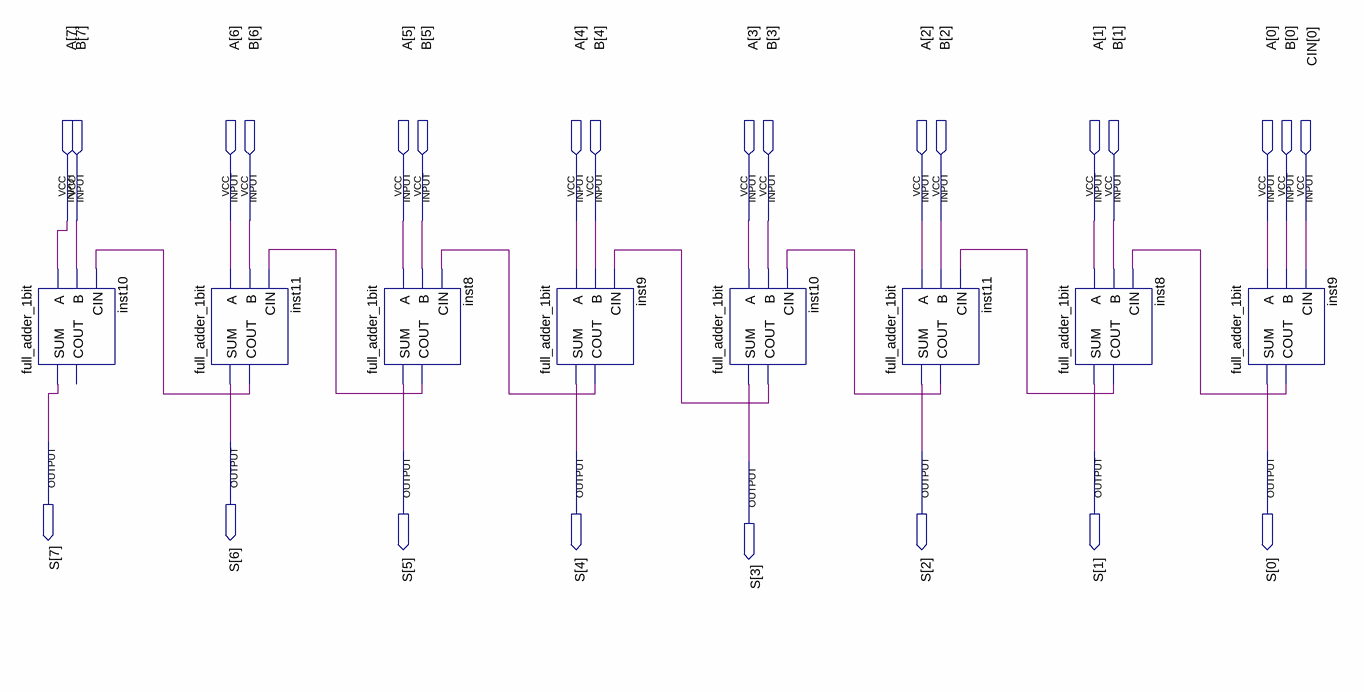
[diagram p0: schematic sheet]
// Quartus schematic full_adder.bdf as structural Verilog: 8 symbols, 25 pins
module full_adder (
  input  [7:0] A,
  input  [7:0] B,
  input  [0:0] CIN,
  output [7:0] S
);

  wire inst8_cout, inst8_cout_2, inst9_cout, inst9_cout_2, inst10_cout, inst11_cout, inst11_cout_2;

  full_adder_1bit inst10 (.A(A[7]), .B(B[7]), .CIN(inst11_cout_2), .SUM(S[7]));  // open: COUT
  full_adder_1bit inst11 (.A(A[6]), .B(B[6]), .CIN(inst8_cout_2), .SUM(S[6]), .COUT(inst11_cout_2));
  full_adder_1bit inst8 (.A(A[5]), .B(B[5]), .CIN(inst9_cout_2), .SUM(S[5]), .COUT(inst8_cout_2));
  full_adder_1bit inst9 (.A(A[4]), .B(B[4]), .CIN(inst10_cout), .SUM(S[4]), .COUT(inst9_cout_2));
  full_adder_1bit inst10_dup2 (.A(A[3]), .B(B[3]), .CIN(inst11_cout), .SUM(S[3]), .COUT(inst10_cout));
  full_adder_1bit inst11_dup2 (.A(A[2]), .B(B[2]), .CIN(inst8_cout), .SUM(S[2]), .COUT(inst11_cout));
  full_adder_1bit inst8_dup2 (.A(A[1]), .B(B[1]), .CIN(inst9_cout), .SUM(S[1]), .COUT(inst8_cout));
  full_adder_1bit inst9_dup2 (.A(A[0]), .B(B[0]), .CIN(CIN[0]), .SUM(S[0]), .COUT(inst9_cout));
endmodule
